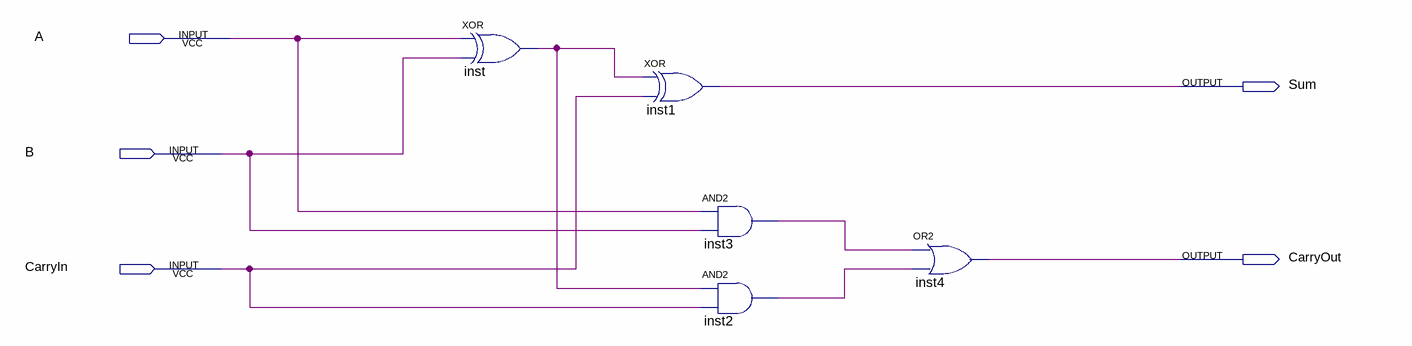
[diagram p0: schematic sheet]
// Quartus schematic somador_completo.bdf as structural Verilog: 5 symbols, 5 pins
module somador_completo (
  input  A,
  input  B,
  input  CarryIn,
  output Sum,
  output CarryOut
);

  wire inst2_out, inst3_out, inst_out;

  xor inst (inst_out, A, B);
  xor inst1 (Sum, inst_out, CarryIn);
  and inst3 (inst3_out, A, B);
  and inst2 (inst2_out, inst_out, CarryIn);
  or inst4 (CarryOut, inst3_out, inst2_out);
endmodule
